# EAGLE design kumand (EAGLE 9.0.1)
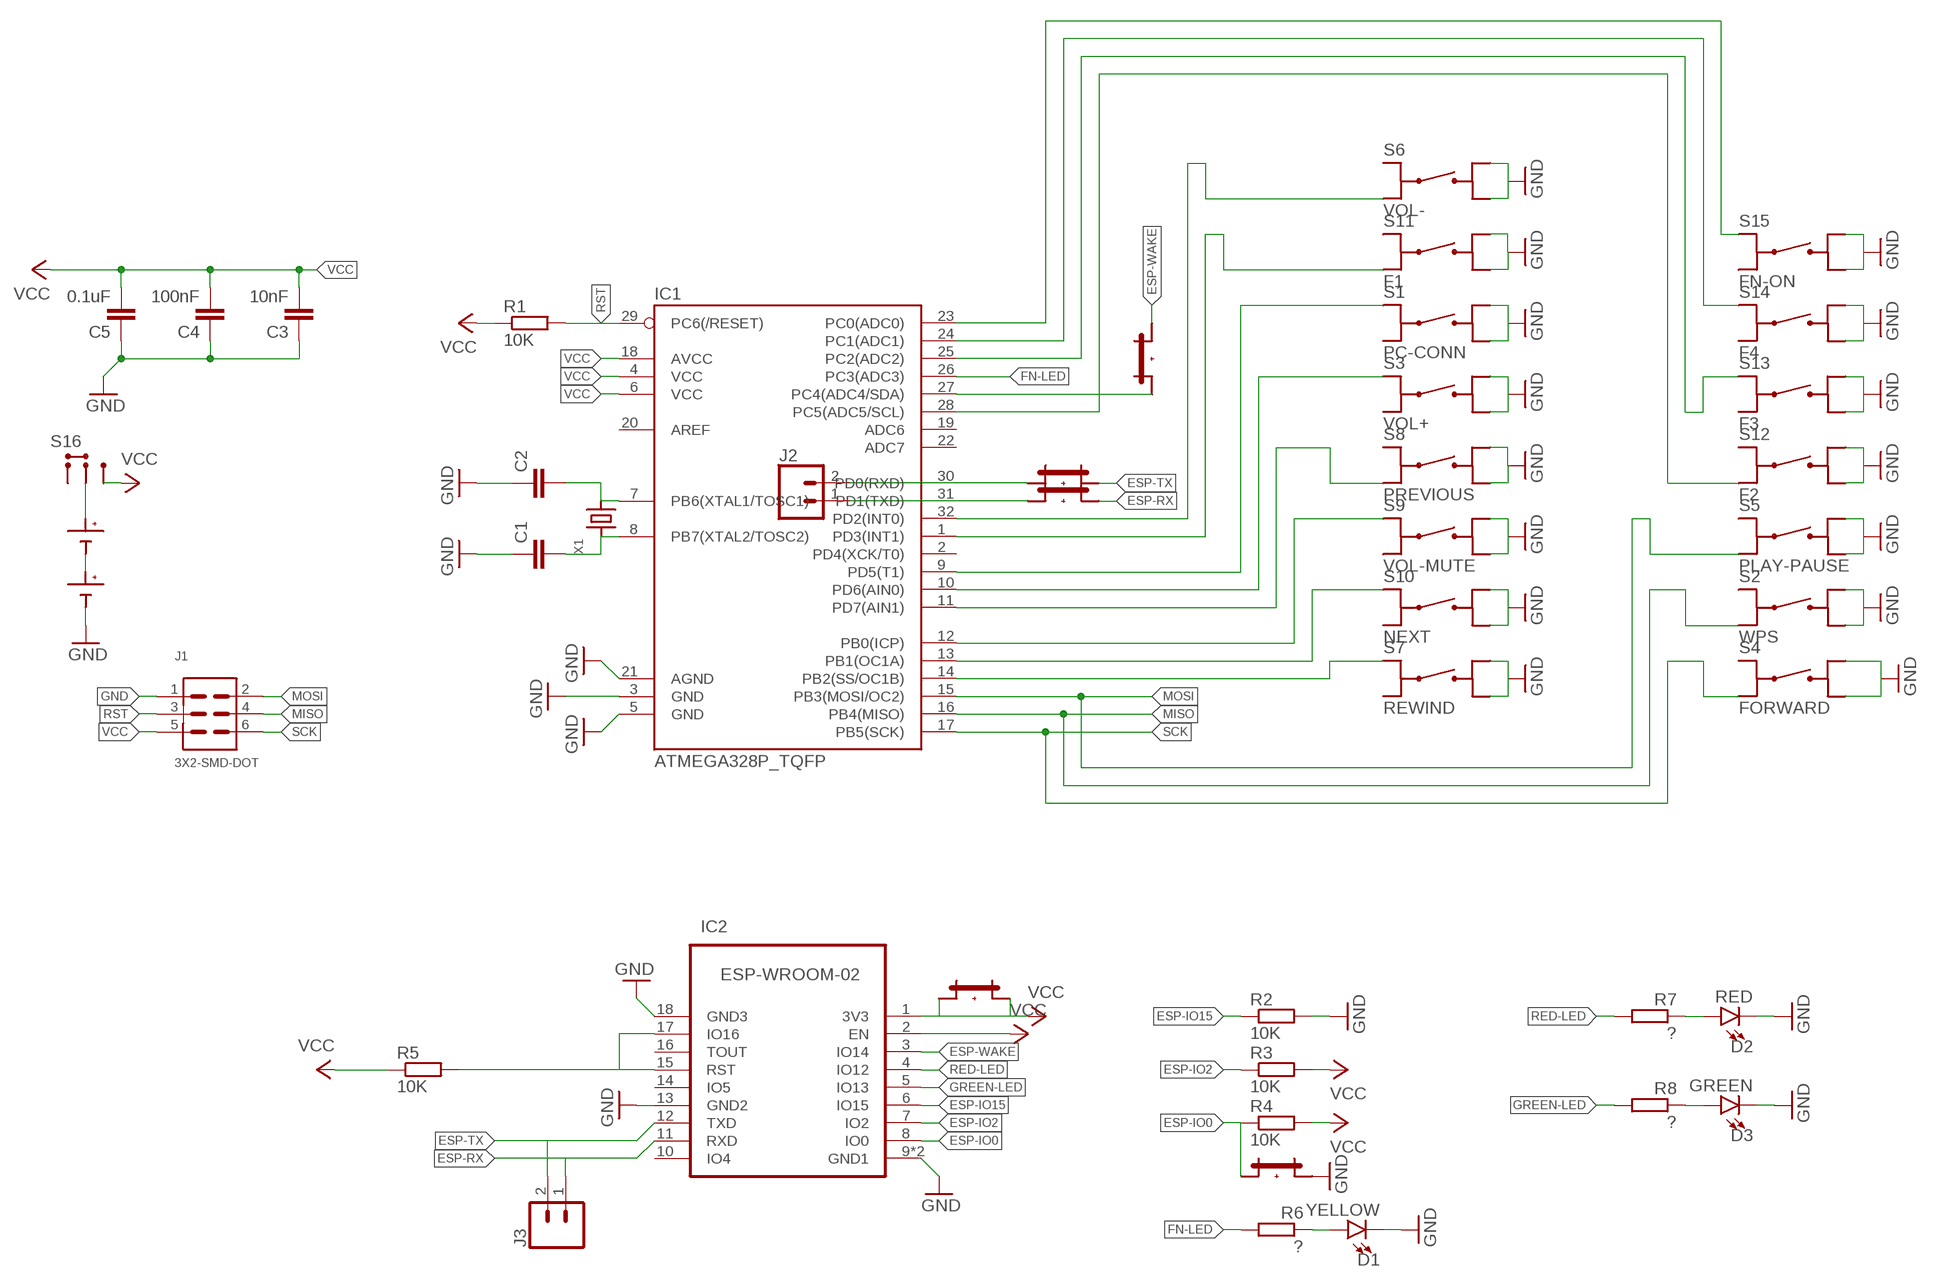
[diagram p0: schematic, sheet 1]

## Parts
C1  C-EUC1206  [C1206]
C2  C-EUC1206  [C1206]
C3  10nF  C-EUC1206  [C1206]
C4  100nF  C-EUC1206  [C1206]
C5  0.1uF  C-EUC1206  [C1206]
D1  YELLOW  LED1206  [LED-1206]
D2  RED  LED1206  [LED-1206]
D3  GREEN  LED1206  [LED-1206]
IC1  ATMEGA328P_TQFP  [TQFP32-08]
IC2  ESP-WROOM-02  ESP-WROOM-02FRONT-FACE  [FRONT-FACE]
J1  3X2-SMD-DOT  [3X2-SMD-DOT]
J2  CONN_02  [1X02]
J3  CONN_02  [1X02]
PRG  SOLDER-JUMPER  [SOLDER-JUMPER-PACKAGE]
R1  10K  R-EU_R1206  [R1206]
R2  10K  R-EU_R1206  [R1206]
R3  10K  R-EU_R1206  [R1206]
R4  10K  R-EU_R1206  [R1206]
R5  10K  R-EU_R1206  [R1206]
R6  ?  R-EU_R1206  [R1206]
R7  ?  R-EU_R1206  [R1206]
R8  ?  R-EU_R1206  [R1206]
RX  SOLDER-JUMPER  [SOLDER-JUMPER-PACKAGE]
S1  PC-CONN  PTS525  [PTS525]
S2  WPS  PTS525  [PTS525]
S3  VOL+  PTS525  [PTS525]
S4  FORWARD  PTS525  [PTS525]
S5  PLAY-PAUSE  PTS525  [PTS525]
S6  VOL-  PTS525  [PTS525]
S7  REWIND  PTS525  [PTS525]
S8  PREVIOUS  PTS525  [PTS525]
S9  VOL-MUTE  PTS525  [PTS525]
S10  NEXT  PTS525  [PTS525]
S11  F1  PTS525  [PTS525]
S12  F2  PTS525  [PTS525]
S13  F3  PTS525  [PTS525]
S14  F4  PTS525  [PTS525]
S15  FN-ON  PTS525  [PTS525]
S16  CL-SB-12B-02T  [CL-SB-12B-02T-PACKAGE]
TX  SOLDER-JUMPER  [SOLDER-JUMPER-PACKAGE]
U$4  BK-82-DEVICE  [BK-82-PACKAGE]
U$5  BK-82-DEVICE  [BK-82-PACKAGE]
VCC  SOLDER-JUMPER  [SOLDER-JUMPER-PACKAGE]
WAKE  SOLDER-JUMPER  [SOLDER-JUMPER-PACKAGE]
X1  NX8045-CRYSTAL  [NX8045]

## Nets
ESP-IO0: IC2.8(IO0) PRG.1 R4.1
ESP-IO2: IC2.7(IO2) R3.1
ESP-IO15: IC2.6(IO15) R2.1
ESP-RST: IC2.15(RST) IC2.17(IO16) R5.2
ESP-RX: IC2.11(RXD) J3.1 RX.2
ESP-TX: IC2.12(TXD) J3.2 TX.2
ESP-WAKE: IC2.3(IO14) WAKE.2
FN-LED: IC1.26(PC3(ADC3)) R6.2
GND: C1.1 C2.1 C3.1 C4.1 C5.1 D1.C D2.C D3.C IC1.3(GND) IC1.5(GND) IC1.21(AGND) IC2.9(GND1) IC2.13(GND2) IC2.18(GND3) IC2.GND(GND1) J1.1 PRG.2 R2.2 S1.3 S1.4 S2.3 S2.4 S3.3 S3.4 S4.3 S4.4 S5.3 S5.4 S6.3 S6.4 S7.3 S7.4 S8.3 S8.4 S9.3 S9.4 S10.3 S10.4 S11.3 S11.4 S12.3 S12.4 S13.3 S13.4 S14.3 S14.4 S15.3 S15.4 U$5.P$2 U$5.P$4
GREEN-LED: IC2.5(IO13) R8.2
MISO: IC1.16(PB4(MISO)) J1.4 S2.2
MOSI: IC1.15(PB3(MOSI/OC2)) J1.2 S5.2
N$1: C1.2 IC1.8(PB7(XTAL2/TOSC2)) X1.P$1
N$2: C2.2 IC1.7(PB6(XTAL1/TOSC1)) X1.P$2
N$4: IC1.27(PC4(ADC4/SDA)) WAKE.1
N$5: IC1.13(PB1(OC1A)) S10.1
N$6: IC1.12(PB0(ICP)) S9.1
N$7: IC1.11(PD7(AIN1)) S8.2
N$8: IC1.10(PD6(AIN0)) S3.1
N$9: IC1.9(PD5(T1)) S1.1
N$11: IC1.1(PD3(INT1)) S11.2
N$12: IC1.32(PD2(INT0)) S6.2
N$13: IC1.28(PC5(ADC5/SCL)) S12.2
N$16: IC1.25(PC2(ADC2)) S13.1
N$17: IC1.24(PC1(ADC1)) S14.1
N$18: IC1.23(PC0(ADC0)) S15.1
N$19: IC1.30(PD0(RXD)) J2.2 TX.1
N$20: IC1.31(PD1(TXD)) J2.1 RX.1
N$21: D1.A R6.1
N$22: U$4.P$2 U$4.P$4 U$5.P$1 U$5.P$3
N$23: IC1.14(PB2(SS/OC1B)) S7.1
N$24: S16.P$2 U$4.P$1 U$4.P$3
N$25: D2.A R7.1
N$26: D3.A R8.1
RED-LED: IC2.4(IO12) R7.2
RST: IC1.29(PC6(/RESET)) J1.3 R1.2
SCK: IC1.17(PB5(SCK)) J1.6 S4.2
VCC: C3.2 C4.2 C5.2 IC1.4(VCC) IC1.6(VCC) IC1.18(AVCC) IC2.1(3V3) IC2.2(EN) J1.5 R1.1 R3.2 R4.2 R5.1 S16.P$3 VCC.1 VCC.2
Unconnected: IC1.2(PD4(XCK/T0)) IC1.19(ADC6) IC1.20(AREF) IC1.22(ADC7) IC2.10(IO4) IC2.14(IO5) IC2.16(TOUT) S1.2 S2.1 S3.2 S4.1 S5.1 S6.1 S7.2 S8.1 S9.2 S10.2 S11.1 S12.1 S13.2 S14.2 S15.2 S16.P$1

## Library data of the parts
C1-C5 = rcl:C-EU: CAPACITOR, European symbol; SPICEPREFIX: C
D1-D3 = SparkFun-LED:LED: LED (Generic) Standard schematic elements and footprints for 5mm, 3mm, 1206, and 0603 sized LEDs. Generic LEDs with no color specified.
IC1 = SparkFun-IC-Microcontroller:ATMEGA328P_TQFP: Popular 328P in QFP Storefront component: ATmega328 - TQFP <https://www.sparkfun.com/products/13448> (COM-13448) Datasheet <http://www.sparkfun.com/datasheets/Components/SMD/ATMega328.pdf> SparkFun Products SparkFun RedBoard - Programmed with Arduino <https://www.sparkfun.com/products/12757> (DEV-12757) Arduino Pro Mini 328 - 5V/16MHz <https://www.sparkfun.com/products/11113> (DEV-11113) Arduino Pro Mini 328 - 3.3V/8MHz <https://www.sparkfun.com/products/11114> (DEV-11114) SparkFun OpenLog <https://www.sparkfun.com/products/13712> (DEV-13712) SparkFun MicroView - OLED Arduino Module <https://www.sparkfun.com/products/12923> (DEV-12923) SparkFun Digital Sandbox <https://www.sparkfun.com/products/12651> (DEV-12651) SparkFun PicoBoard <https://www.sparkfun.com/products/11888> (WIG-11888) Arduino Fio <https://www.sparkfun.com/products/10116> (DEV-10116) LilyPad Arduino 328 Main Board <https://www.sparkfun.com/products/13342> (DEV-13342) SparkFun RedStick <https://www.sparkfun.com/products/13741> (DEV-13741) LilyPad MP3 <https://www.sparkfun.com/products/11013> (DEV-11013) LilyPad Arduino SimpleSnap <https://www.sparkfun.com/products/10941> (DEV-10941) SparkFun Stepoko <https://www.sparkfun.com/products/13899> (ROB-13899) SparkFun Geiger Counter <https://www.sparkfun.com/products/11345> (SEN-11345) SparkFun EL Sequencer <https://www.sparkfun.com/products/12781> (COM-12781) Arduino Pro 328 - 5V/16MHz <https://www.sparkfun.com/products/10915> (DEV-10915) CryptoCape <https://www.sparkfun.com/products/12773> (DEV-12773) SparkFun IR Thermometer Evaluation Board - MLX90614 <https://www.sparkfun.com/products/10740> (SEN-10740) SparkFun RedBot Mainboard <https://www.sparkfun.com/products/12097> (ROB-12097) Arduino Pro 328 - 3.3V/8MHz <https://www.sparkfun.com/products/10914> (DEV-10914) SparkFun Block for Intel® Edison - Arduino <https://www.sparkfun.com/products/13036> (DEV-13036) SparkFun Simon Says - Surface Mount Soldering Kit <https://www.sparkfun.com/products/10935> (KIT-10935) SparkFun 7-Segment Serial Display - Red <https://www.sparkfun.com/products/11441> (COM-11441) SparkFun 7-Segment Serial Display - White <https://www.sparkfun.com/products/11629> (COM-11629) SparkFun 7-Segment Serial Display - Yellow <https://www.sparkfun.com/products/11443> (COM-11443) SparkFun 7-Segment Serial Display - Kelly Green <https://www.sparkfun.com/products/11440> (COM-11440) SparkFun 7-Segment Serial Display - Blue <https://www.sparkfun.com/products/11442> (COM-11442) SparkFun OpenSegment Serial Display - 20mm (Blue) <https://www.sparkfun.com/products/11647> (COM-11647) SparkFun OpenSegment Serial Display - 20mm (Green) <https://www.sparkfun.com/products/11646> (COM-11646) SparkFun OpenSegment Serial Display - 20mm (White) <https://www.sparkfun.com/products/11648> (COM-11648) SparkFun OpenSegment Serial Display - 20mm (Red) <https://www.sparkfun.com/products/11644> (COM-11644) SparkFun OpenSegment Serial Display - 20mm (Yellow) <https://www.sparkfun.com/products/11645> (COM-11645) SparkFun OpenSegment Shield <https://www.sparkfun.com/products/13190> (DEV-13190); PROD_ID: IC-09069
IC2 = esp-wroom-02:ESP-WROOM-02: WiFi module - ESP-WROOM-02
J1 = Connector:3X2-SMD-DOT
J2 J3 = SparkFun-Connectors:CONN_02: Multi connection point. Often used as Generic Header-pin footprint for 0.1 inch spaced/style header connections On any of the 0.1 inch spaced packages, you can populate with these: Break Away Headers - Straight <https://www.sparkfun.com/products/116> (PRT-00116) Break Away Male Headers - Right Angle <https://www.sparkfun.com/products/553> (PRT-00553) Female Headers <https://www.sparkfun.com/products/115> (PRT-00115) Break Away Headers - Machine Pin <https://www.sparkfun.com/products/117> (PRT-00117) Break Away Female Headers - Swiss Machine Pin <https://www.sparkfun.com/products/743> (PRT-00743) For SCREWTERMINALS and SPRING TERMINALS visit here: Screw Terimnals on SparkFun.com <https://www.sparkfun.com/search/results?term=Screw+Terminals> (5mm/3.5mm/2.54mm spacing) This device is also useful as a general connection point to wire up your design to another part of your project. Our various solder wires solder well into these plated through hole pads. Hook-Up Wire - Assortment (Stranded, 22 AWG) <https://www.sparkfun.com/products/11375> (PRT-11375) Hook-Up Wire - Assortment (Solid Core, 22 AWG) <https://www.sparkfun.com/products/11367> (PRT-11367) View the entire wire category on our website here <https://www.sparkfun.com/categories/141> Special notes: Molex polarized connector foot print use with: PRT-08233 with associated crimp pins and housings. 2.54_SCREWTERM for use with PRT-10571. 3.5mm Screw Terminal footprints for PRT-08084 5mm Screw Terminal footprints for use with PRT-08432
PRG RX TX VCC WAKE = Solder-Jumper:SOLDER-JUMPER
R1 = resistor:R-EU_: RESISTOR, European symbol
R2-R8 = rcl:R-EU_: RESISTOR, European symbol; SPICEPREFIX: R
S1-S15 = C&K:PTS525
S16 = Nidec Copal Electronics:CL-SB-12B-02T
U$4 U$5 = BK-82 AAA Battery Holder:BK-82-DEVICE
X1 = NX8045-CRYSTAL:NX8045-CRYSTAL

## Board
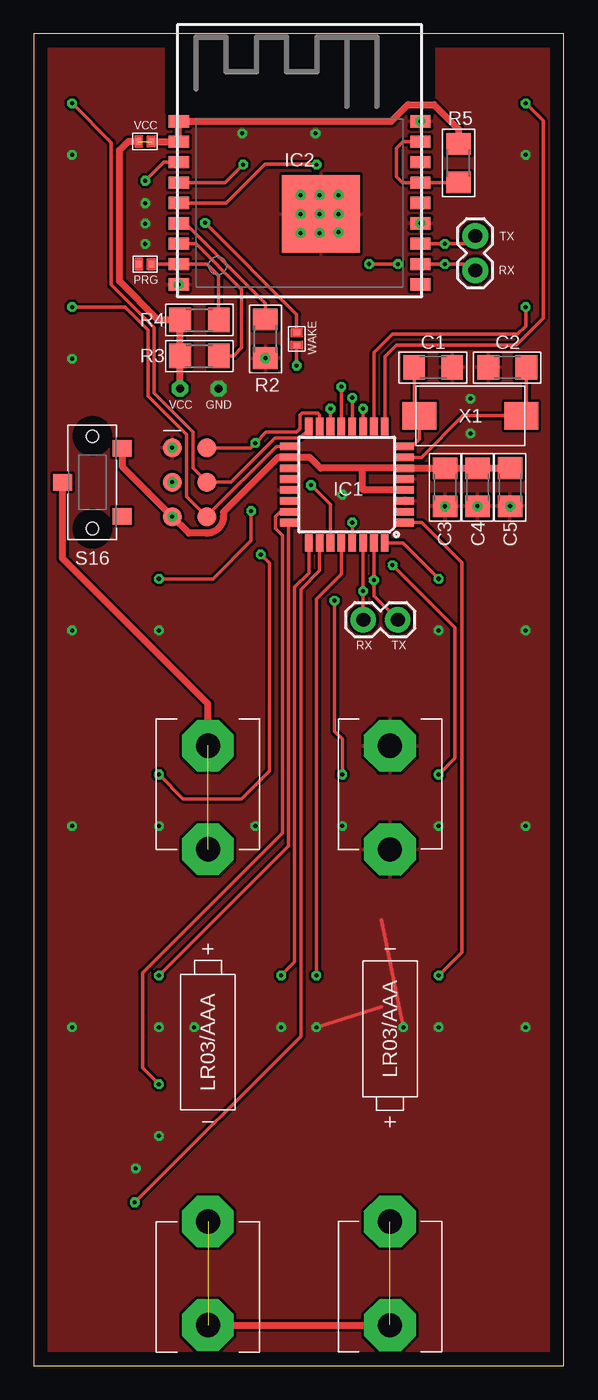
[diagram p1: board, top side]
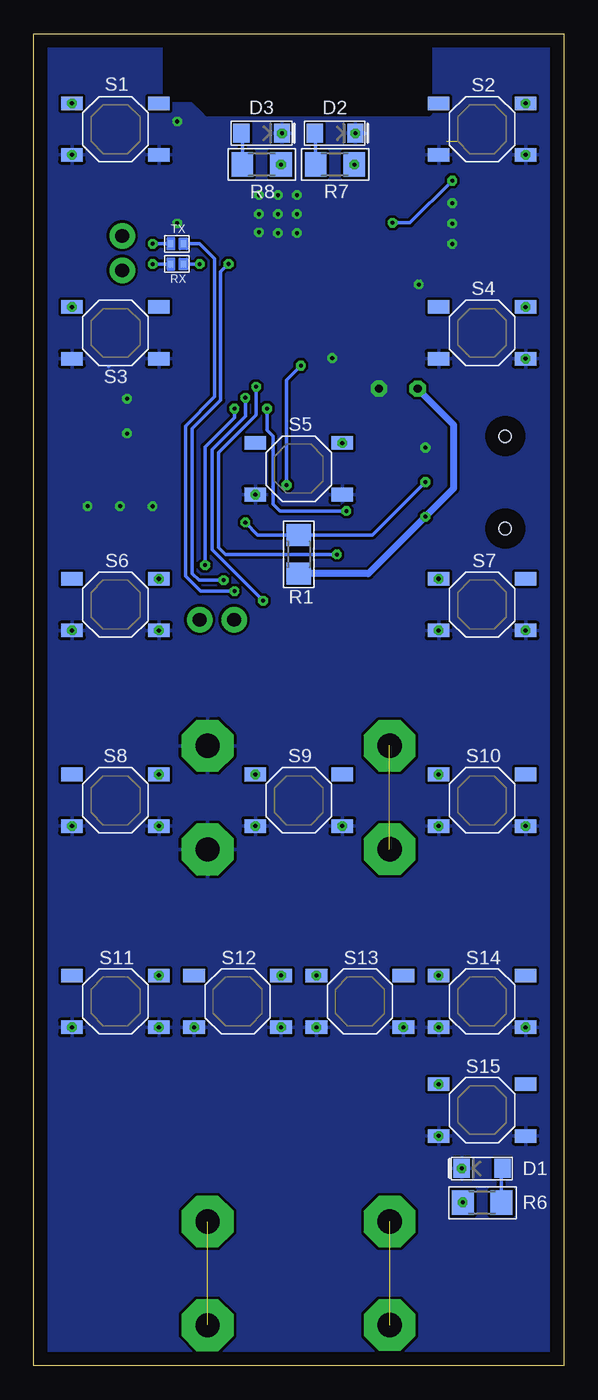
[diagram p2: board, bottom side, seen from below]

Size 39 x 98 mm. Coordinates in mm from the lower left corner, seen from the top.
Outline: 0,0 39,0 39,98 0,98 0,0
Copper layers (1+16): Top 0.035mm / dielectric 1mm / Bottom 0.035mm
Design rules "default *": minimum track width 5mil, minimum drill 0.25mm, track to track 6mil, track to pad 6mil, pad to pad 6mil, via to via 6mil, smd to smd 6mil, copper to edge 40mil, drill to drill 6mil, minimum pad ring 10mil, minimum via ring 8mil, stop-mask expansion 4mil, vias tented up to drill 0.6mm, thermal gap 9mil
tRestrict: area 10,92.3 to 29.2,97.9; area 31.3,62.6 to 31.6,62.7; area 31.3,63.8 to 31.6,63.9; area 31.3,65.2 to 31.6,65.3; area 33.7,65.2 to 34,65.3; area 33.7,63.8 to 34,63.9; area 33.7,62.6 to 34,62.7; area 33.7,66.7 to 34,66.8; area 31.3,66.7 to 31.6,66.8; area 27.7,92.1 to 29.2,92.3
bRestrict: area 10,92.3 to 29.2,97.9

### Footprints (pad centres in the part's own frame; a part is rotated, then mirrored left to right if it is on the bottom)
C1206 = smd 1.6 x 1.8: 1 -1.4,0; 2 1.4,0
LED-1206 = smd 1.2 x 1.4: A -1.5,0; C 1.5,0
TQFP32-08 = smd 1.27 x 0.559: 1 -4.293,2.8; 2 -4.293,2; 3 -4.293,1.2; 4 -4.293,0.4; 5 -4.293,-0.4; 6 -4.293,-1.2; 7 -4.293,-2; 8 -4.293,-2.8; 17 4.293,-2.8; 18 4.293,-2; 19 4.293,-1.2; 20 4.293,-0.4; 21 4.293,0.4; 22 4.293,1.2; 23 4.293,2; 24 4.293,2.8 | smd 0.559 x 1.27: 9 -2.8,-4.293; 10 -2,-4.293; 11 -1.2,-4.293; 12 -0.4,-4.293; 13 0.4,-4.293; 14 1.2,-4.293; 15 2,-4.293; 16 2.8,-4.293; 25 2.8,4.293; 26 2,4.293; 27 1.2,4.293; 28 0.4,4.293; 29 -0.4,4.293; 30 -1.2,4.293; 31 -2,4.293; 32 -2.8,4.293
FRONT-FACE = smd 1.485 x 0.9: 1 -8.893,4.9; 2 -8.893,3.4; 3 -8.893,1.9; 4 -8.893,0.4; 5 -8.893,-1.1; 6 -8.893,-2.6; 7 -8.893,-4.1; 8 -8.893,-5.6; 9 -8.893,-7.1; 10 8.893,-7.1; 11 8.893,-5.6; 12 8.893,-4.1; 13 8.893,-2.6; 14 8.893,-1.1; 15 8.893,0.4; 16 8.893,1.9; 17 8.893,3.4; 18 8.893,4.9 | smd 5.715 x 5.715: GND 1.582,-1.91
3X2-SMD-DOT = smd 1.4 x 1.4: 1 -1.27,2.54; 2 1.27,2.54; 3 -1.27,0; 4 1.27,0; 5 -1.27,-2.54; 6 1.27,-2.54
1X02 = drill 1.016 pad 1.88: 1 0,0; 2 2.54,0
SOLDER-JUMPER-PACKAGE = smd 0.4 x 0.5: 1 -0.474,0; 2 0.474,0
R1206 = smd 1.6 x 1.803: 1 -1.422,0; 2 1.422,0
PTS525 = smd 1.6 x 1: 1 -3.2,1.9; 2 3.2,1.9; 3 -3.2,-1.9; 4 3.2,-1.9
CL-SB-12B-02T-PACKAGE = smd 1.2 x 1.4: P$1 -2.5,-2.2; P$2 0,2.2; P$3 2.5,-2.2 | hole 0.9: -3.4,0; 3.4,0
BK-82-PACKAGE = drill 1.78 pad 3.81 octagon: P$1 0,13.69; P$2 0,-13.71; P$3 0,21.31; P$4 0,-21.33
NX8045 = smd 2.5 x 2: P$1 -3.75,0; P$2 3.75,0

### Placement (x,y rotation side)
C1  29.4,73.46 180 top
C2  34.85,73.47 0 top
C3  30.27,64.64 90 top
C4  32.66,64.64 90 top
C5  35.06,64.64 90 top
D1  6,14.5 180 bottom
D2  16.83,90.69 0 bottom
D3  22.23,90.69 0 bottom
IC1  23.04,64.84 180 top
IC2  19.56,86.66 0 top
J1  11.45,65.02 0 top
J2  26.8,54.89 180 top
J3  32.5,80.6 90 top
PRG  8.19,81.06 180 top
R1  19.49,59.71 90 bottom
R2  17.04,75.56 270 top
R3  12.19,74.3 180 top
R4  12.19,76.94 180 top
R5  31.26,88.49 270 top
R6  6,12.01 180 bottom
R7  16.83,88.39 0 bottom
R8  22.23,88.39 0 bottom
RX  28.46,81.07 180 bottom
S1  33,91 0 bottom
S2  6,91 0 bottom
S3  33,76 0 bottom
S4  6,76 0 bottom
S5  19.5,66 0 bottom
S6  33,56 0 bottom
S7  6,56 0 bottom
S8  33,41.6 0 bottom
S9  19.5,41.6 0 bottom
S10  6,41.6 0 bottom
S11  33,26.8 0 bottom
S12  24,26.8 0 bottom
S13  15,26.8 0 bottom
S14  6,26.8 0 bottom
S15  6,18.8 0 bottom
S16  4.3,65 90 top
TX  28.46,82.56 180 bottom
U$4  12.81,24.31 0 top
U$5  26.22,24.28 180 top
VCC  8.18,90.09 180 top
WAKE  19.34,75.56 90 top
X1  32.14,69.89 0 top

### Tracks (layer width: path | path; a pad name or v marks a point on that pad's centre or on a via)
ESP-IO0
  Top 0.254: R4.1 13.6,76.95 13.6,80.2 12.74,81.06 IC2.8 PRG.1
ESP-IO2
  Top 0.254: R3.1 14.7,74.3 15.3,74.9 15.3,79.2 11.94,82.56 IC2.7
ESP-IO15
  Top 0.254: 11.04,84.06 IC2.6 11.14,84.06 17.04,78.16 R2.1
ESP-RST
  Top 0.254: R5.2 IC2.15 27.14,87.06 26.7,87.5 26.7,89.6 27.16,90.06 IC2.17
ESP-RX  (via drill 0.3 pad 0.6)
  Top 0.254: 28.6,81.06 IC2.11 28.44,81.05 | 28.6,81.06 v30.25,81.06 32.04,81.06 J3.1 | 28.59,81.05 28.6,81.06
  Bottom 0.254: RX.2 v30.25,81.06
ESP-TX  (via drill 0.3 pad 0.6)
  Top 0.254: IC2.12 | IC2.12 v30.25,82.56 31.92,82.56 J3.2 | 28.44,82.55 IC2.12
  Bottom 0.254: TX.2 v30.25,82.56
ESP-WAKE  (via drill 0.3 pad 0.6)
  Top 0.254: WAKE.2 19.34,77.36 v12.6,84.1 | v8.2,87.2 9.56,88.56 IC2.3
  Bottom 0.254: v12.6,84.1 11.3,84.1 v8.2,87.2
FN-LED  (via drill 0.3 pad 0.6)
  Top 0.254: IC1.26 21.04,58.5 19.65,57.12 19.65,24.24 R6.2
  other vias: 7.42,12.01
GND  (via drill 0.3 pad 0.6, 0.6 pad 1.2)
  Top 0.254: S12.3 25.6,32.8 | S12.4 25.6,26.4 | S14.4 2.8,25.1 | D2.C | D2.C 15.3,90.7 | D2.C 15.5,90.7 | D3.C 20.7,90.7
  Bottom 0.254: C3.1 30.4,63.11 30.4,63.1 | C5.1 35.01,63.2 35,63.2 | S3.4 29.5,74.47 | 33.48,73.5 33.5,73.5
  Bottom 0.508: J1.1 10.2,67.58
  other vias: 10.18,67.56 19.64,83.35 21.04,83.35 19.64,84.75 21.04,84.75 22.44,84.75 19.64,86.15 21.04,86.15 22.44,86.15 30.27,63.24 35.06,63.24 32.15,71.15 32.15,68.6 32.66,63.24 22.44,83.4 8.2,84.05 8.2,82.55 8.2,85.55 28.45,84.06 13.6,71.9 2.8,89.1 36.2,89.1 2.8,74.1 22.7,64.1 2.8,54.1 36.2,54.1 29.8,39.7 22.7,39.7 9.2,39.7 9.2,24.9 27.2,24.9 20.8,24.9 36.2,24.9 29.8,24.9 2.8,39.7 36.2,39.7 16.3,39.7 9.2,54.1 29.8,54.1 28.45,91.56 17.04,74.14 10.66,79.56 18.2,24.9 11.8,24.9 2.8,24.9 9.2,16.9 15.33,90.69 20.73,90.69 7.5,14.5
  pour Top (isolate 0.2): 0,98 0,0 39,0 39,98
  pour Bottom (isolate 0.2): 0,98 0,0 39,0 39,98
GREEN-LED  (via drill 0.3 pad 0.6)
  Top 0.254: 11.16,85.56 IC2.5 14.16,85.56 17,88.4 R8.2
  other vias: 20.81,88.39
MISO  (via drill 0.3 pad 0.6)
  Top 0.254: IC1.16 20.24,68.94 19.55,68.25 17.75,68.25 14.52,65.02 J1.4 11.7,66.04 11.7,68.7 8.85,71.55 8.85,76.4 5.7,79.55 5.7,90 S2.2
  other vias: 2.8,92.9
MOSI  (via drill 0.3 pad 0.6)
  Top 0.254: IC1.15 21.04,69.96 20.9,70.1 19.75,70.1 19.6,69.95 19.6,68.95 19.35,68.7 17.1,68.7 S5.2 15.94,67.54 12.74,67.54 | 12.78,67.5 12.74,67.54 | 12.74,67.54 J1.2
  other vias: 16.3,67.9
N$1
  Top 0.254: C1.2 28,70.28 X1.P$1 28.4,68.2 27.84,67.64 IC1.8 | IC1.8 27.54,67.64 | IC1.8 27.64,67.64 | IC1.8 27.74,67.64
N$2
  Top 0.254: C2.2 36.25,70.25 X1.P$2 | 27.37,66.8 IC1.7 28.54,66.84 31.6,69.9 X1.P$2 | X1.P$2 35.79,69.89 arc-90 35.6,69.7
N$4  (via drill 0.3 pad 0.6)
  Top 0.254: IC1.27 21.84,63.36 v20.4,64.8 | v19.34,73.59 WAKE.1
  Bottom 0.254: v20.4,64.8 20.4,72.53 v19.34,73.59
N$5  (via drill 0.3 pad 0.6)
  Top 0.254: IC1.13 v22.64,72.03 | v16.7,59.7 17.35,59.05 17.35,43.75 15.3,41.7 11,41.7 S10.1
  Bottom 0.254: v22.64,72.03 22.64,69.96 25.4,67.2 25.4,60.2 24.9,59.7 v16.7,59.7
  other vias: 9.2,43.5
N$6  (via drill 0.3 pad 0.6)
  Top 0.254: IC1.12 v23.44,71.23 | v22.13,56.3 22.13,46.67 22.7,46.1 S9.1
  Bottom 0.254: v23.44,71.23 23.44,69.86 25.9,67.4 25.9,60.06 v22.13,56.3
  other vias: 22.7,43.5
N$7  (via drill 0.3 pad 0.6)
  Top 0.254: IC1.11 v24.24,70.43 | v26.4,58.9 31,54.3 31,44.7 S8.2
  Bottom 0.254: v24.24,70.43 24.24,69.76 26.4,67.6 v26.4,58.9
  other vias: 29.8,43.5
N$8  (via drill 0.3 pad 0.6)
  Top 0.254: IC1.10 25.04,74.54 26.4,75.9 35.6,75.9 36.2,76.5 S3.1
  other vias: 36.2,77.9
N$9  (via drill 0.3 pad 0.6)
  Top 0.254: IC1.9 25.84,74.24 26.7,75.1 35.5,75.1 37.5,77.1 37.5,91.6 S1.1
  other vias: 36.2,92.9
N$11  (via drill 0.3 pad 0.6)
  Top 0.254: IC1.1 28.56,62.04 31.5,59.1 31.5,30.4 S11.2
  other vias: 29.8,28.7
N$12  (via drill 0.3 pad 0.6)
  Top 0.254: S6.2 27.15,60.55 IC1.32
  other vias: 29.8,57.9
N$13  (via drill 0.3 pad 0.6)
  Top 0.254: IC1.28 22.64,58.24 20.8,56.4 S12.2
  other vias: 20.8,28.7
N$16  (via drill 0.3 pad 0.6)
  Top 0.254: IC1.25 20.24,58.34 19.2,57.3 19.2,29.7 S13.1
  other vias: 18.2,28.7
N$17  (via drill 0.3 pad 0.6)
  Top 0.254: IC1.24 18.74,38.24 S14.1
  other vias: 9.2,28.7
N$18  (via drill 0.3 pad 0.6)
  Top 0.254: IC1.23 18.14,62.84 17.8,62.5 17.8,61.6 18.3,61.1 18.3,39.2 8,28.9 8,21.9 S15.1
  other vias: 9.2,20.7
N$19  (via drill 0.3 pad 0.6)
  Top 0.254: 24.24,60.04 IC1.30 24.24,57.09 v24.24,56.99 24.24,55.21 | 24.24,55.21 | 24.24,55.21 J2.2
  Bottom 0.254: v24.24,56.99 26.74,56.99 27.85,58.1 27.85,69.15 25.7,71.3 25.7,81.45 26.8,82.55 TX.1
N$20  (via drill 0.3 pad 0.6)
  Top 0.254: 25.04,60.04 IC1.31 25.04,57.9 v25.04,57.8 25.04,56.65 J2.1 | v26.79,81.07 v24.68,81.07 v24.67,81.08
  Bottom 0.254: v25.04,57.8 26.85,57.8 27.35,58.3 27.35,68.95 25.25,71.05 25.25,80.5 v24.67,81.08 | RX.1 26.59,81.07 v26.79,81.07
N$21
  Bottom 0.254: R6.1 4.58,14.42 D1.A
N$22  (2 unrouted)
  Top 0.508: U$4.P$4 U$5.P$3
  Bottom 0.508: 26.22,3 U$5.P$3
N$23  (via drill 0.3 pad 0.6)
  Top 0.254: v21.84,70.43 IC1.14 | v16,62.9 16,60.7 13.2,57.9 S7.1
  Bottom 0.254: v16,62.9 18.9,62.9 20.9,62.9 21.4,63.4 21.4,68.4 21.83,68.83 v21.84,70.43
  other vias: 9.2,57.9
N$24  (1 unrouted)
  Top 0.508: U$4.P$3 12.81,48.69 2.1,59.4 S16.P$2
N$25
  Bottom 0.254: R7.1 18.25,90.61 D2.A
N$26
  Bottom 0.254: R8.1 23.66,90.61 D3.A
RED-LED  (via drill 0.3 pad 0.6)
  Top 0.254: 11.16,87.06 IC2.4 14.08,87.06 R7.2
  other vias: 15.41,88.39
RST  (via drill 0.3 pad 0.6)
  Top 0.254: IC1.29 v23.44,62.05
  Bottom 0.254: v23.44,62.05 22.52,61.13 R1.2 14.07,61.13 J1.3
  other vias: 10.18,65.02
SCK  (via drill 0.3 pad 0.6)
  Top 0.254: IC1.17 17.85,67.65 12.82,62.62 J1.6 11.25,63.95 11.25,68.5 8.4,71.35 8.4,76.2 6.7,77.9 S4.2
  other vias: 2.8,77.9
VCC  (via drill 0.3 pad 0.6, 0.6 pad 1.2)  (1 unrouted)
  Top 0.305: C3.2 | C4.2
  Top 0.508: C3.2 IC1.6 24.29,66.04 | C3.2 C4.2 | C4.2 C5.2 | IC1.18 17.99,66.84 13.95,62.8 13.95,62.5 arc-90 12.7,61.25 11.41,61.25 J1.5 6.5,66.16 S16.P$3 | 27.32,64.45 IC1.4 24.26,64.44 24.2,64.5 24.2,65.95 | 18.76,66.85 IC1.18 | 24.2,65.95 24.29,66.04 | 24.2,65.95 arc-90 24.29,66.04 | 24.29,66.04 21.11,66.04 20.31,66.84 IC1.18 | R5.1 31.26,90.99 29.45,92.8 27.55,92.8 26.31,91.56 IC2.1 IC2.2 10.64,90.09 VCC.1 | VCC.2 6.94,90.09 6.3,89.45 6.3,79.8 9.16,76.94 | R3.2 | R3.2 R4.2 9.16,76.94 | 9.14,76.94 9.16,76.94 | v10.75,71.9 10.77,71.92 R3.2
  Bottom 0.254: 19.39,58.18 R1.1
  Bottom 0.508: v10.75,71.9 8.1,69.25 8.1,64.56 J1.5 14.37,58.28 R1.1 19.89,58.28
  other vias: 10.18,62.48

### Text on the board
tNames: TX | RX | VCC | GND | RX | TX